# EAGLE design MPL115A1-Breakout-v12 (EAGLE 6.2)
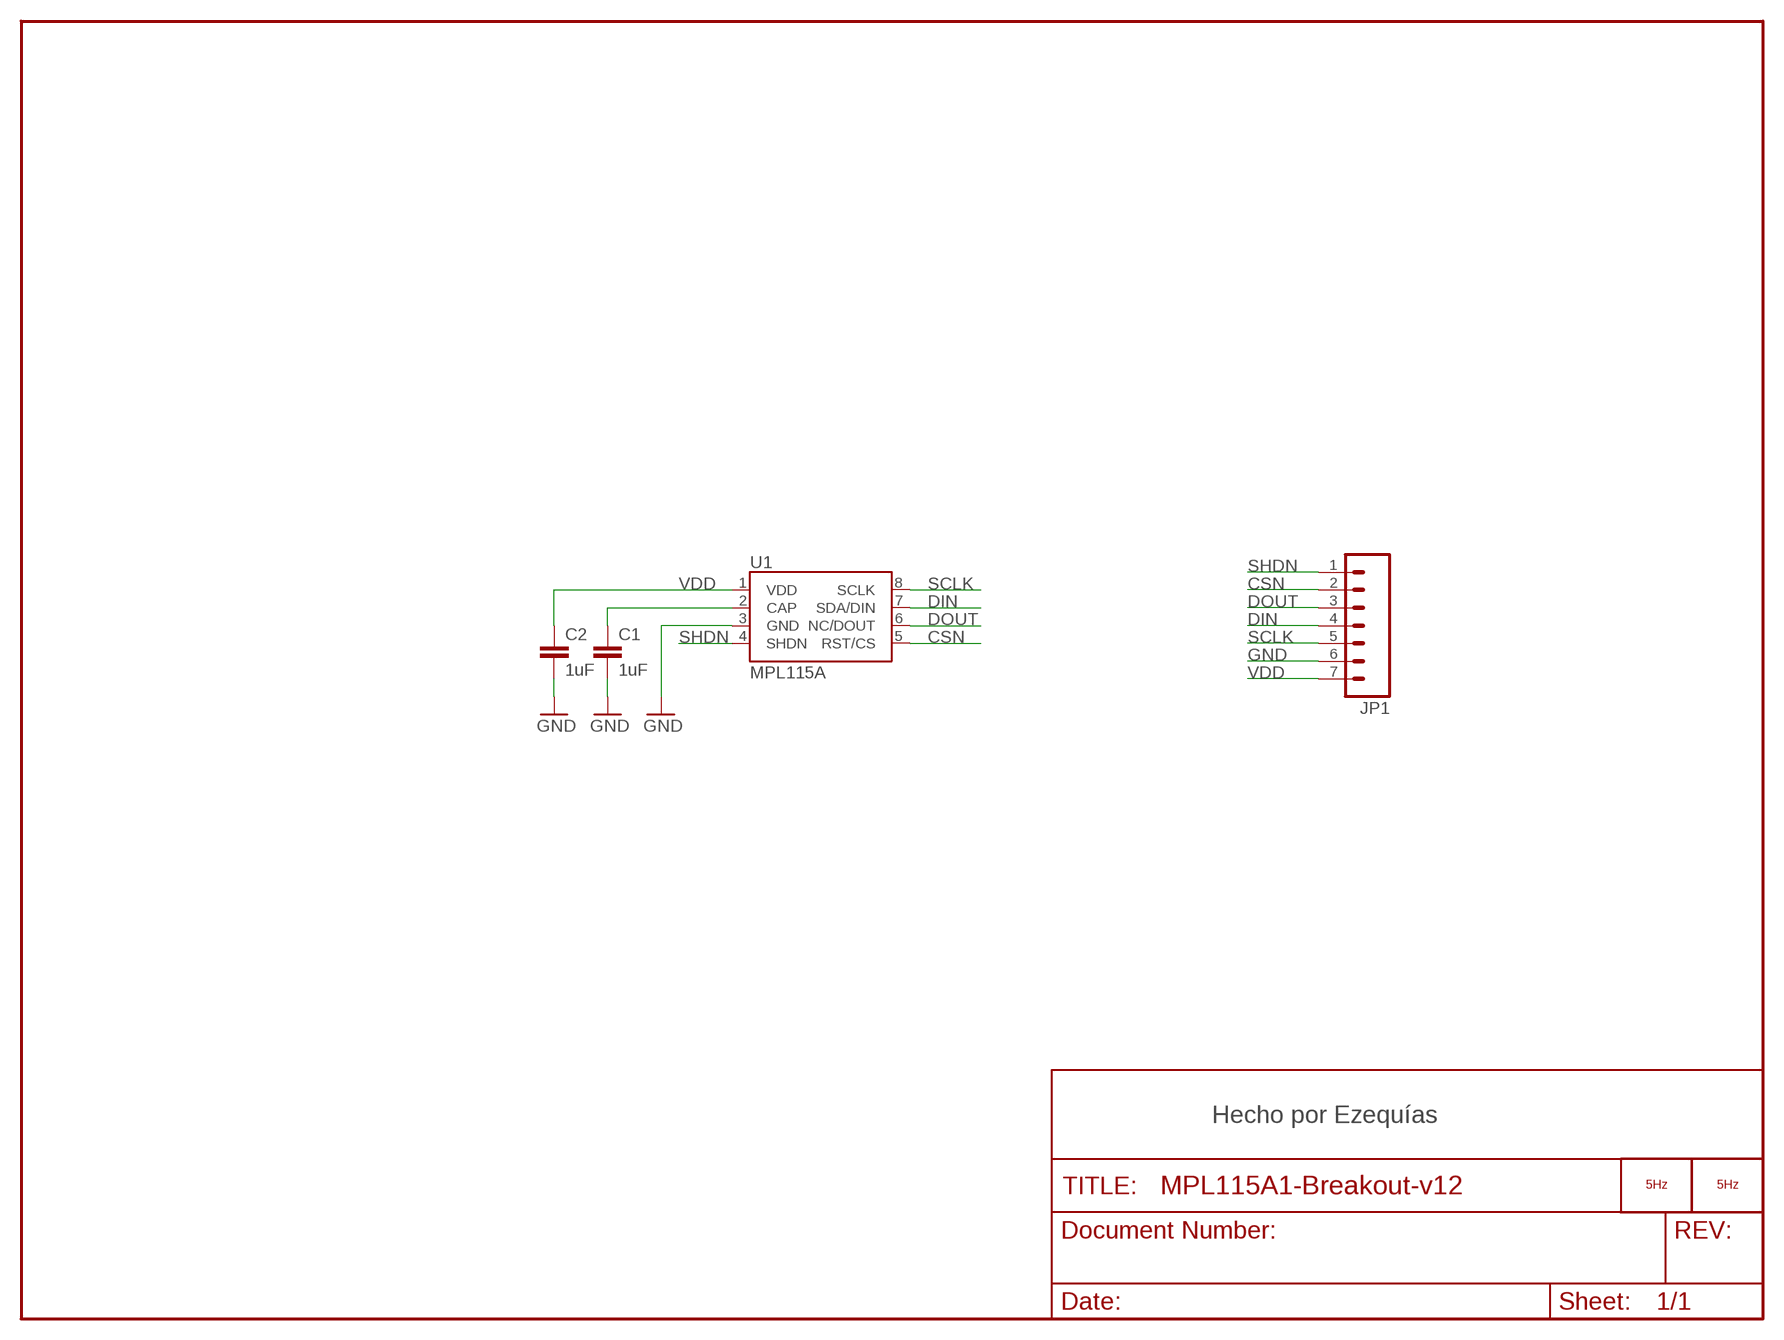
[diagram p0: schematic, sheet 1]

## Parts
C1  1uF  CAP0603-CAP  [0603-CAP]
C2  1uF  CAP0603-CAP  [0603-CAP]
JP1  M07  [1X07]
LOGO1  LOGO_5HZ_H_COOPER_10MM  [5HZ_LOGO_H_COOPER_10MM]
LOGO2  LOGO_5HZ_H_5MM  [5HZ_LOGO_H_5MM]
U1  MPL115A  [LGA8]

## Nets
CAP: C1.1 U1.2(CAP)
CSN: JP1.2 U1.5(RST/CS)
DIN: JP1.4 U1.7(SDA/DIN)
DOUT: JP1.3 U1.6(NC/DOUT)
GND: C1.2 C2.2 JP1.6 U1.3(GND)
SCLK: JP1.5 U1.8(SCLK)
SHDN: JP1.1 U1.4(SHDN)
VDD: C2.1 JP1.7 U1.1(VDD)

## Notes on the sheet
- Hecho por Ezequías

## Library data of the parts
C1 C2 = SparkFun:CAP: Capacitor Standard 0603 ceramic capacitor, and 0.1" leaded capacitor.
JP1 = SparkFun:M07: Header 7 Standard 7-pin 0.1" header. Use with straight break away headers (SKU : PRT-00116), right angle break away headers (PRT-00553), swiss pins (PRT-00743), machine pins (PRT-00117), and female headers (PRT-00115). NOTES ON THE VARIANTS LOCK and LOCK_LONGPADS... This footprint was designed to help hold the alignment of a through-hole component (i.e. 7-pin header) while soldering it into place. You may notice that each hole has been shifted either up or down by 0.005 of an inch from it's more standard position (which is usually a perfectly straight line). This slight alteration caused the pins (the squares in the middle) to touch the edges of the holes. Because they are alternating, it causes a "brace" to hold the header in place. 0.005 has proven to be the perfect amount of "off-center" position when using our standard breakaway headers. Although looks a little odd when you look at the bare footprint, once you have a header in there, the alteration is very hard to notice. Also, if you push a header all the way into place, it is covered up entirely on the bottom side. This idea of altering the position of holes to aid alignment will be further integrated into the Sparkfun Library for other footprints. It can help hold any component with 3 or more connection pins.
LOGO1 LOGO2 = 5hz-electronica:LOGO_5HZ: Logotipo 5Hz "según Pedro"
U1 = SparkFun:MPL115A: MPL115A1 (SPI) and MPL115A2 (I2C) Miniature Digital Barometer 5.0x3.0x1.2mm LGA Package

## Board
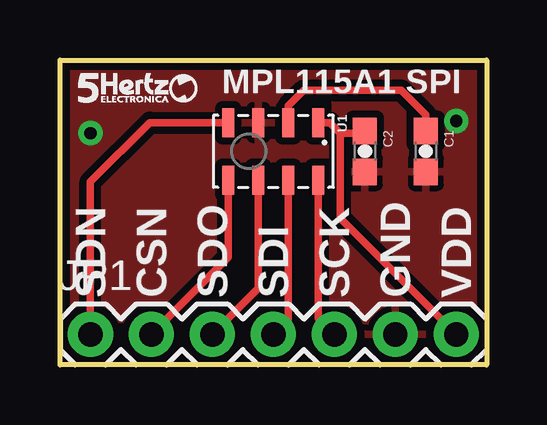
[diagram p1: board, top side]
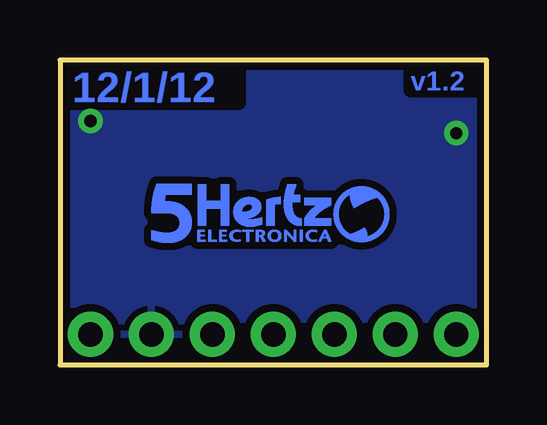
[diagram p2: board, bottom side, seen from below]

Size 17.78 x 12.7 mm. Coordinates in mm from the lower left corner, seen from the top.
Outline: 0,12.7 17.78,12.7 17.78,0 0,0 0,12.7
Copper layers (1*16): Top 0.035mm / dielectric 1.5mm / Bottom 0.035mm
Design rules: minimum track width 8mil, minimum drill 20mil, track to track 8mil, track to pad 8mil, pad to pad 8mil, via to via 8mil, smd to smd 8mil, copper to edge 9mil, drill to drill 8mil, minimum pad ring 12mil, minimum via ring 10mil, stop-mask expansion 4mil, vias tented up to drill 20mil, thermal gap 10mil

### Footprints (pad centres in the part's own frame; a part is rotated, then mirrored left to right if it is on the bottom)
0603-CAP = smd 1.1 x 1: 1 -0.85,0; 2 0.85,0
1X07 = drill 1.016 pad 1.88: 1 0,0; 2 2.54,0; 3 5.08,0; 4 7.62,0; 5 10.16,0; 6 12.7,0; 7 15.24,0
LGA8 = smd 1.2 x 0.5: 1 -1.2,1.875; 2 -1.2,0.625; 3 -1.2,-0.625; 4 -1.2,-1.875; 5 1.2,-1.875; 6 1.2,-0.625; 7 1.2,0.625; 8 1.2,1.875

### Placement (x,y rotation side)
C1  15.24,8.89 270 top
C2  12.7,8.89 270 top
JP1  1.27,1.27 0 top
LOGO1  13.97,5.08 0 bottom
LOGO2  0.76,10.92 0 top
U1  8.89,8.89 270 top

### Tracks (layer width: path | path; a pad name or v marks a point on that pad's centre or on a via)
CAP
  Top 0.305: U1.2 9.52,10.79 10.16,11.43 14.22,11.43 15.24,10.41 C1.1
CSN
  Top 0.305: JP1.2 7.01,4.47 U1.5
DIN
  Top 0.305: U1.7 9.52,1.9 JP1.4
DOUT
  Top 0.305: U1.6 8.27,3.19 JP1.3
GND  (via drill 0.51)
  other vias: 1.27,9.65 16.51,10.16
  pour Bottom (isolate 0.305): 0,0 0,12.7 17.78,12.7 17.78,0
  pour Top (isolate 0.305): 0,0 0,12.7 17.78,12.7 17.78,0
SCLK
  Top 0.305: U1.8 10.77,1.94 JP1.5
SHDN
  Top 0.305: U1.4 3.74,10.09 1.27,7.62 JP1.1
VDD
  Top 0.305: JP1.7 11.68,6.1 11.68,9.65 | U1.1 11.25,10.09 11.68,9.65 | 11.68,9.65 12.61,9.65 C2.1

### Text on the board
Bottom: v1.2 | 12/1/12
tPlace: MPL115A1 SPI | SDN | CSN | SDO | SDI | SCK | GND | VDD